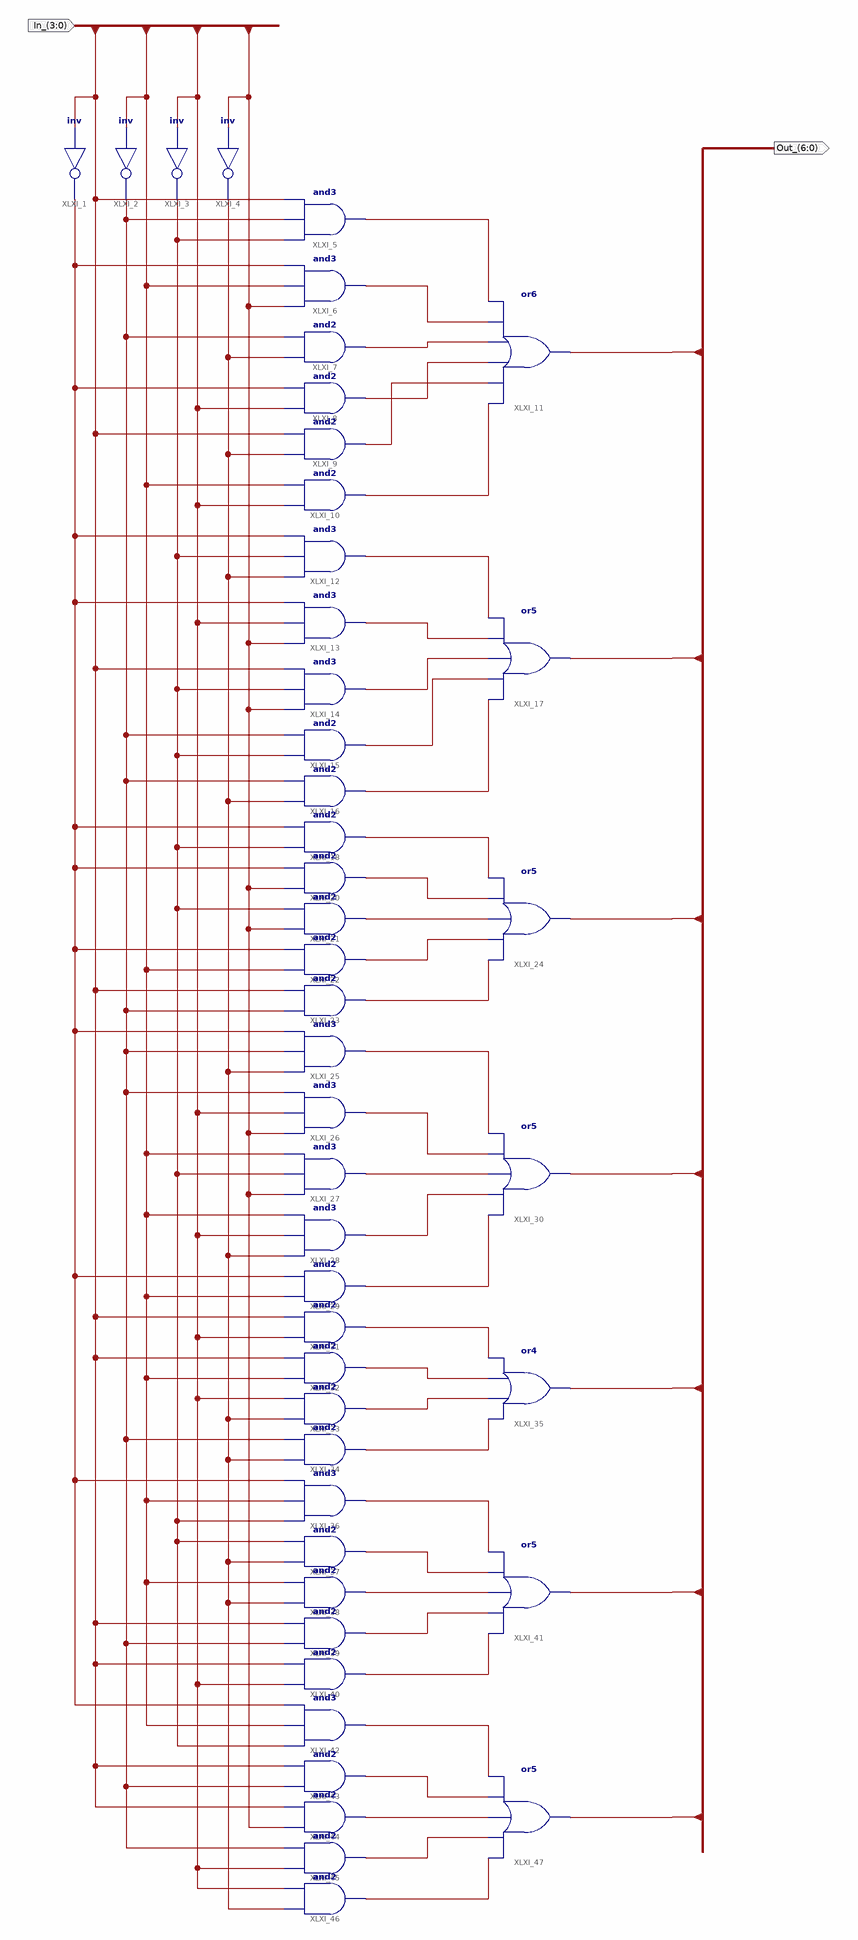
[diagram p0: schematic sheet 1]
// Xilinx ISE schematic BinarytoHex7seg.sch (spartan6) as structural Verilog: 46 symbols, 2 ports
module BinarytoHex7seg (
  input  [3:0] In_,
  output [6:0] Out_
);

  wire XLXN_10, XLXN_11, XLXN_12, XLXN_16, XLXN_17, XLXN_18, XLXN_19, XLXN_22, XLXN_23, XLXN_24, XLXN_25,
       XLXN_26, XLXN_27, XLXN_28, XLXN_30, XLXN_31, XLXN_32, XLXN_33, XLXN_34, XLXN_35, XLXN_36, XLXN_37,
       XLXN_38, XLXN_39, XLXN_40, XLXN_41, XLXN_42, XLXN_43, XLXN_44, XLXN_45, XLXN_46, XLXN_47, XLXN_48,
       XLXN_49, XLXN_50, XLXN_51, XLXN_52, XLXN_53, XLXN_54;

  not XLXI_1 (XLXN_54, In_[3]);
  not XLXI_2 (XLXN_10, In_[2]);
  not XLXI_3 (XLXN_11, In_[1]);
  not XLXI_4 (XLXN_12, In_[0]);
  and XLXI_5 (XLXN_16, XLXN_11, XLXN_10, In_[3]);
  and XLXI_6 (XLXN_17, In_[0], In_[2], XLXN_54);
  and XLXI_7 (XLXN_18, XLXN_12, XLXN_10);
  and XLXI_8 (XLXN_19, In_[1], XLXN_54);
  and XLXI_9 (XLXN_22, XLXN_12, In_[3]);
  and XLXI_10 (XLXN_23, In_[1], In_[2]);
  or XLXI_11 (Out_[6], XLXN_23, XLXN_22, XLXN_19, XLXN_18, XLXN_17, XLXN_16);
  and XLXI_12 (XLXN_24, XLXN_12, XLXN_11, XLXN_54);
  and XLXI_13 (XLXN_25, In_[0], In_[1], XLXN_54);
  and XLXI_14 (XLXN_26, In_[0], XLXN_11, In_[3]);
  and XLXI_15 (XLXN_27, XLXN_11, XLXN_10);
  and XLXI_16 (XLXN_28, XLXN_12, XLXN_10);
  or XLXI_17 (Out_[5], XLXN_28, XLXN_27, XLXN_26, XLXN_25, XLXN_24);
  and XLXI_18 (XLXN_30, XLXN_11, XLXN_54);
  and XLXI_20 (XLXN_31, In_[0], XLXN_54);
  and XLXI_21 (XLXN_32, In_[0], XLXN_11);
  and XLXI_22 (XLXN_33, In_[2], XLXN_54);
  and XLXI_23 (XLXN_34, XLXN_10, In_[3]);
  or XLXI_24 (Out_[4], XLXN_34, XLXN_33, XLXN_32, XLXN_31, XLXN_30);
  and XLXI_25 (XLXN_35, XLXN_12, XLXN_10, XLXN_54);
  and XLXI_26 (XLXN_36, In_[0], In_[1], XLXN_10);
  and XLXI_27 (XLXN_37, In_[0], XLXN_11, In_[2]);
  and XLXI_28 (XLXN_38, XLXN_12, In_[1], In_[2]);
  and XLXI_29 (XLXN_39, In_[2], XLXN_54);
  or XLXI_30 (Out_[3], XLXN_39, XLXN_38, XLXN_37, XLXN_36, XLXN_35);
  and XLXI_31 (XLXN_40, In_[1], In_[3]);
  and XLXI_32 (XLXN_41, In_[2], In_[3]);
  and XLXI_33 (XLXN_42, XLXN_12, In_[1]);
  and XLXI_34 (XLXN_43, XLXN_12, XLXN_10);
  or XLXI_35 (Out_[2], XLXN_43, XLXN_42, XLXN_41, XLXN_40);
  and XLXI_36 (XLXN_44, XLXN_11, In_[2], XLXN_54);
  and XLXI_37 (XLXN_45, XLXN_12, XLXN_11);
  and XLXI_38 (XLXN_46, XLXN_12, In_[2]);
  and XLXI_39 (XLXN_47, XLXN_10, In_[3]);
  and XLXI_40 (XLXN_48, In_[1], In_[3]);
  or XLXI_41 (Out_[1], XLXN_48, XLXN_47, XLXN_46, XLXN_45, XLXN_44);
  and XLXI_42 (XLXN_49, XLXN_11, In_[2], XLXN_54);
  and XLXI_43 (XLXN_50, XLXN_10, In_[3]);
  and XLXI_44 (XLXN_51, In_[0], In_[3]);
  and XLXI_45 (XLXN_52, In_[1], XLXN_10);
  and XLXI_46 (XLXN_53, XLXN_12, In_[1]);
  or XLXI_47 (Out_[0], XLXN_53, XLXN_52, XLXN_51, XLXN_50, XLXN_49);
endmodule
